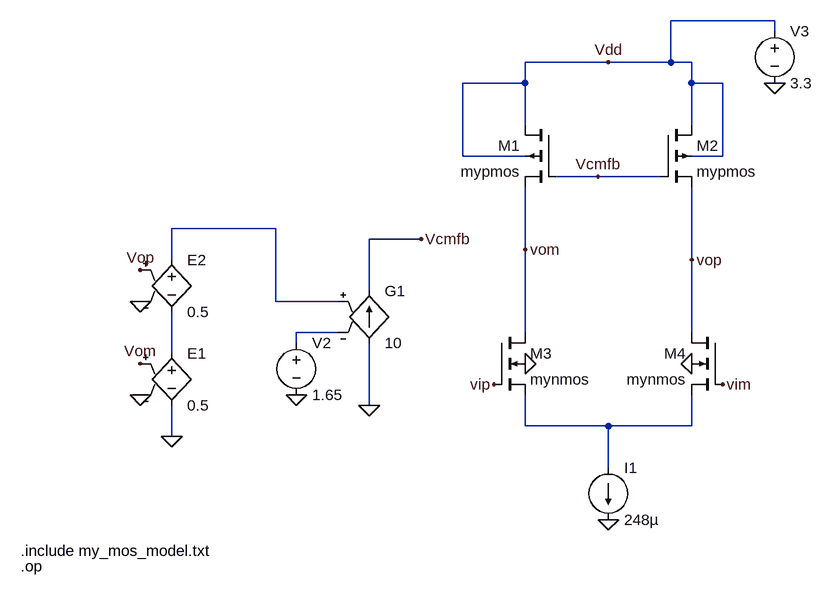
[diagram p0: schematic transconductor.asc]
transconductor.asc, the LTspice schematic file:
Version 4
SHEET 1 1412 680
WIRE 528 -368 368 -368
WIRE 528 -352 528 -368
WIRE 272 -304 144 -304
WIRE 368 -304 368 -368
WIRE 368 -304 272 -304
WIRE 400 -304 368 -304
WIRE 144 -272 144 -304
WIRE 144 -272 48 -272
WIRE 400 -272 400 -304
WIRE 448 -272 400 -272
WIRE 144 -208 144 -272
WIRE 400 -208 400 -272
WIRE 48 -160 48 -272
WIRE 144 -160 48 -160
WIRE 448 -160 448 -272
WIRE 448 -160 400 -160
WIRE 256 -128 192 -128
WIRE 352 -128 256 -128
WIRE -240 -48 -400 -48
WIRE -16 -32 -96 -32
WIRE 144 -16 144 -112
WIRE -400 0 -400 -48
WIRE 400 0 400 -112
WIRE -96 48 -96 -32
WIRE -240 64 -240 -48
WIRE -144 64 -240 64
WIRE -144 112 -208 112
WIRE 144 112 144 -16
WIRE 400 112 400 0
WIRE -208 128 -208 112
WIRE -400 144 -400 80
WIRE -96 224 -96 128
WIRE 144 256 144 208
WIRE 272 256 144 256
WIRE 400 256 400 208
WIRE 400 256 272 256
WIRE -400 272 -400 224
WIRE 272 320 272 256
FLAG 272 -304 Vdd
FLAG 400 0 vop
FLAG 144 -16 vom
FLAG 96 192 vip
FLAG 448 192 vim
FLAG -448 208 0
FLAG -448 64 0
FLAG -448 16 Vop
FLAG -448 160 Vom
FLAG -400 272 0
FLAG -96 224 0
FLAG -16 -32 Vcmfb
FLAG 256 -128 Vcmfb
FLAG 528 -272 0
FLAG 144 160 0
FLAG 400 160 0
FLAG 272 400 0
FLAG -208 208 0
SYMBOL nmos4 96 112 R0
SYMATTR InstName M3
SYMATTR Value mynmos
SYMATTR Value2 l=0.5u w=3.37u m=4
SYMBOL nmos4 448 112 M0
SYMATTR InstName M4
SYMATTR Value mynmos
SYMATTR Value2 l=0.5u w=3.37u m=4
SYMBOL pmos4 192 -208 M0
SYMATTR InstName M1
SYMATTR Value mypmos
SYMATTR Value2 l=0.5u w=3.37u m=14
SYMBOL pmos4 352 -208 R0
SYMATTR InstName M2
SYMATTR Value mypmos
SYMATTR Value2 l=0.5u w=3.37u m=14
SYMBOL e -400 128 R0
SYMATTR InstName E1
SYMATTR Value 0.5
SYMBOL e -400 -16 R0
SYMATTR InstName E2
SYMATTR Value 0.5
SYMBOL voltage 528 -368 R0
WINDOW 123 0 0 Left 0
WINDOW 39 0 0 Left 0
SYMATTR InstName V3
SYMATTR Value 3.3
SYMBOL current 272 320 R0
WINDOW 123 0 0 Left 0
WINDOW 39 0 0 Left 0
SYMATTR InstName I1
SYMATTR Value 248µ
SYMBOL g -96 32 R0
SYMATTR InstName G1
SYMATTR Value 10
SYMBOL voltage -208 112 R0
WINDOW 123 0 0 Left 0
WINDOW 39 0 0 Left 0
SYMATTR InstName V2
SYMATTR Value 1.65
TEXT -632 448 Left 2 !.include my_mos_model.txt
TEXT -632 472 Left 2 !.op

The netlist it stands for:
* transconductor.asc
M3 vom vip N004 0 mynmos l=0.5u w=3.37u m=4
M4 vop vim N004 0 mynmos l=0.5u w=3.37u m=4
M1 Vdd Vcmfb vom Vdd mypmos l=0.5u w=3.37u m=14
M2 Vdd Vcmfb vop Vdd mypmos l=0.5u w=3.37u m=14
E1 N003 0 vom 0 0.5
E2 N001 N003 vop 0 0.5
V3 Vdd 0 3.3
I1 N004 0 248µ
G1 0 Vcmfb N001 N002 10
V2 N002 0 1.65
.model NMOS NMOS
.model PMOS PMOS
.lib standard.mos
.include my_mos_model.txt
.op
.backanno
.end